# EasyEDA Pro project stm32devboard_f103c6.eprj

# Schematic Schematic1
Create Date: 2022-06-30; Page Name: P1; Project Name: stm32devboard_f103c6; Schematic Name: Schematic1; Update Date: 2022-09-17
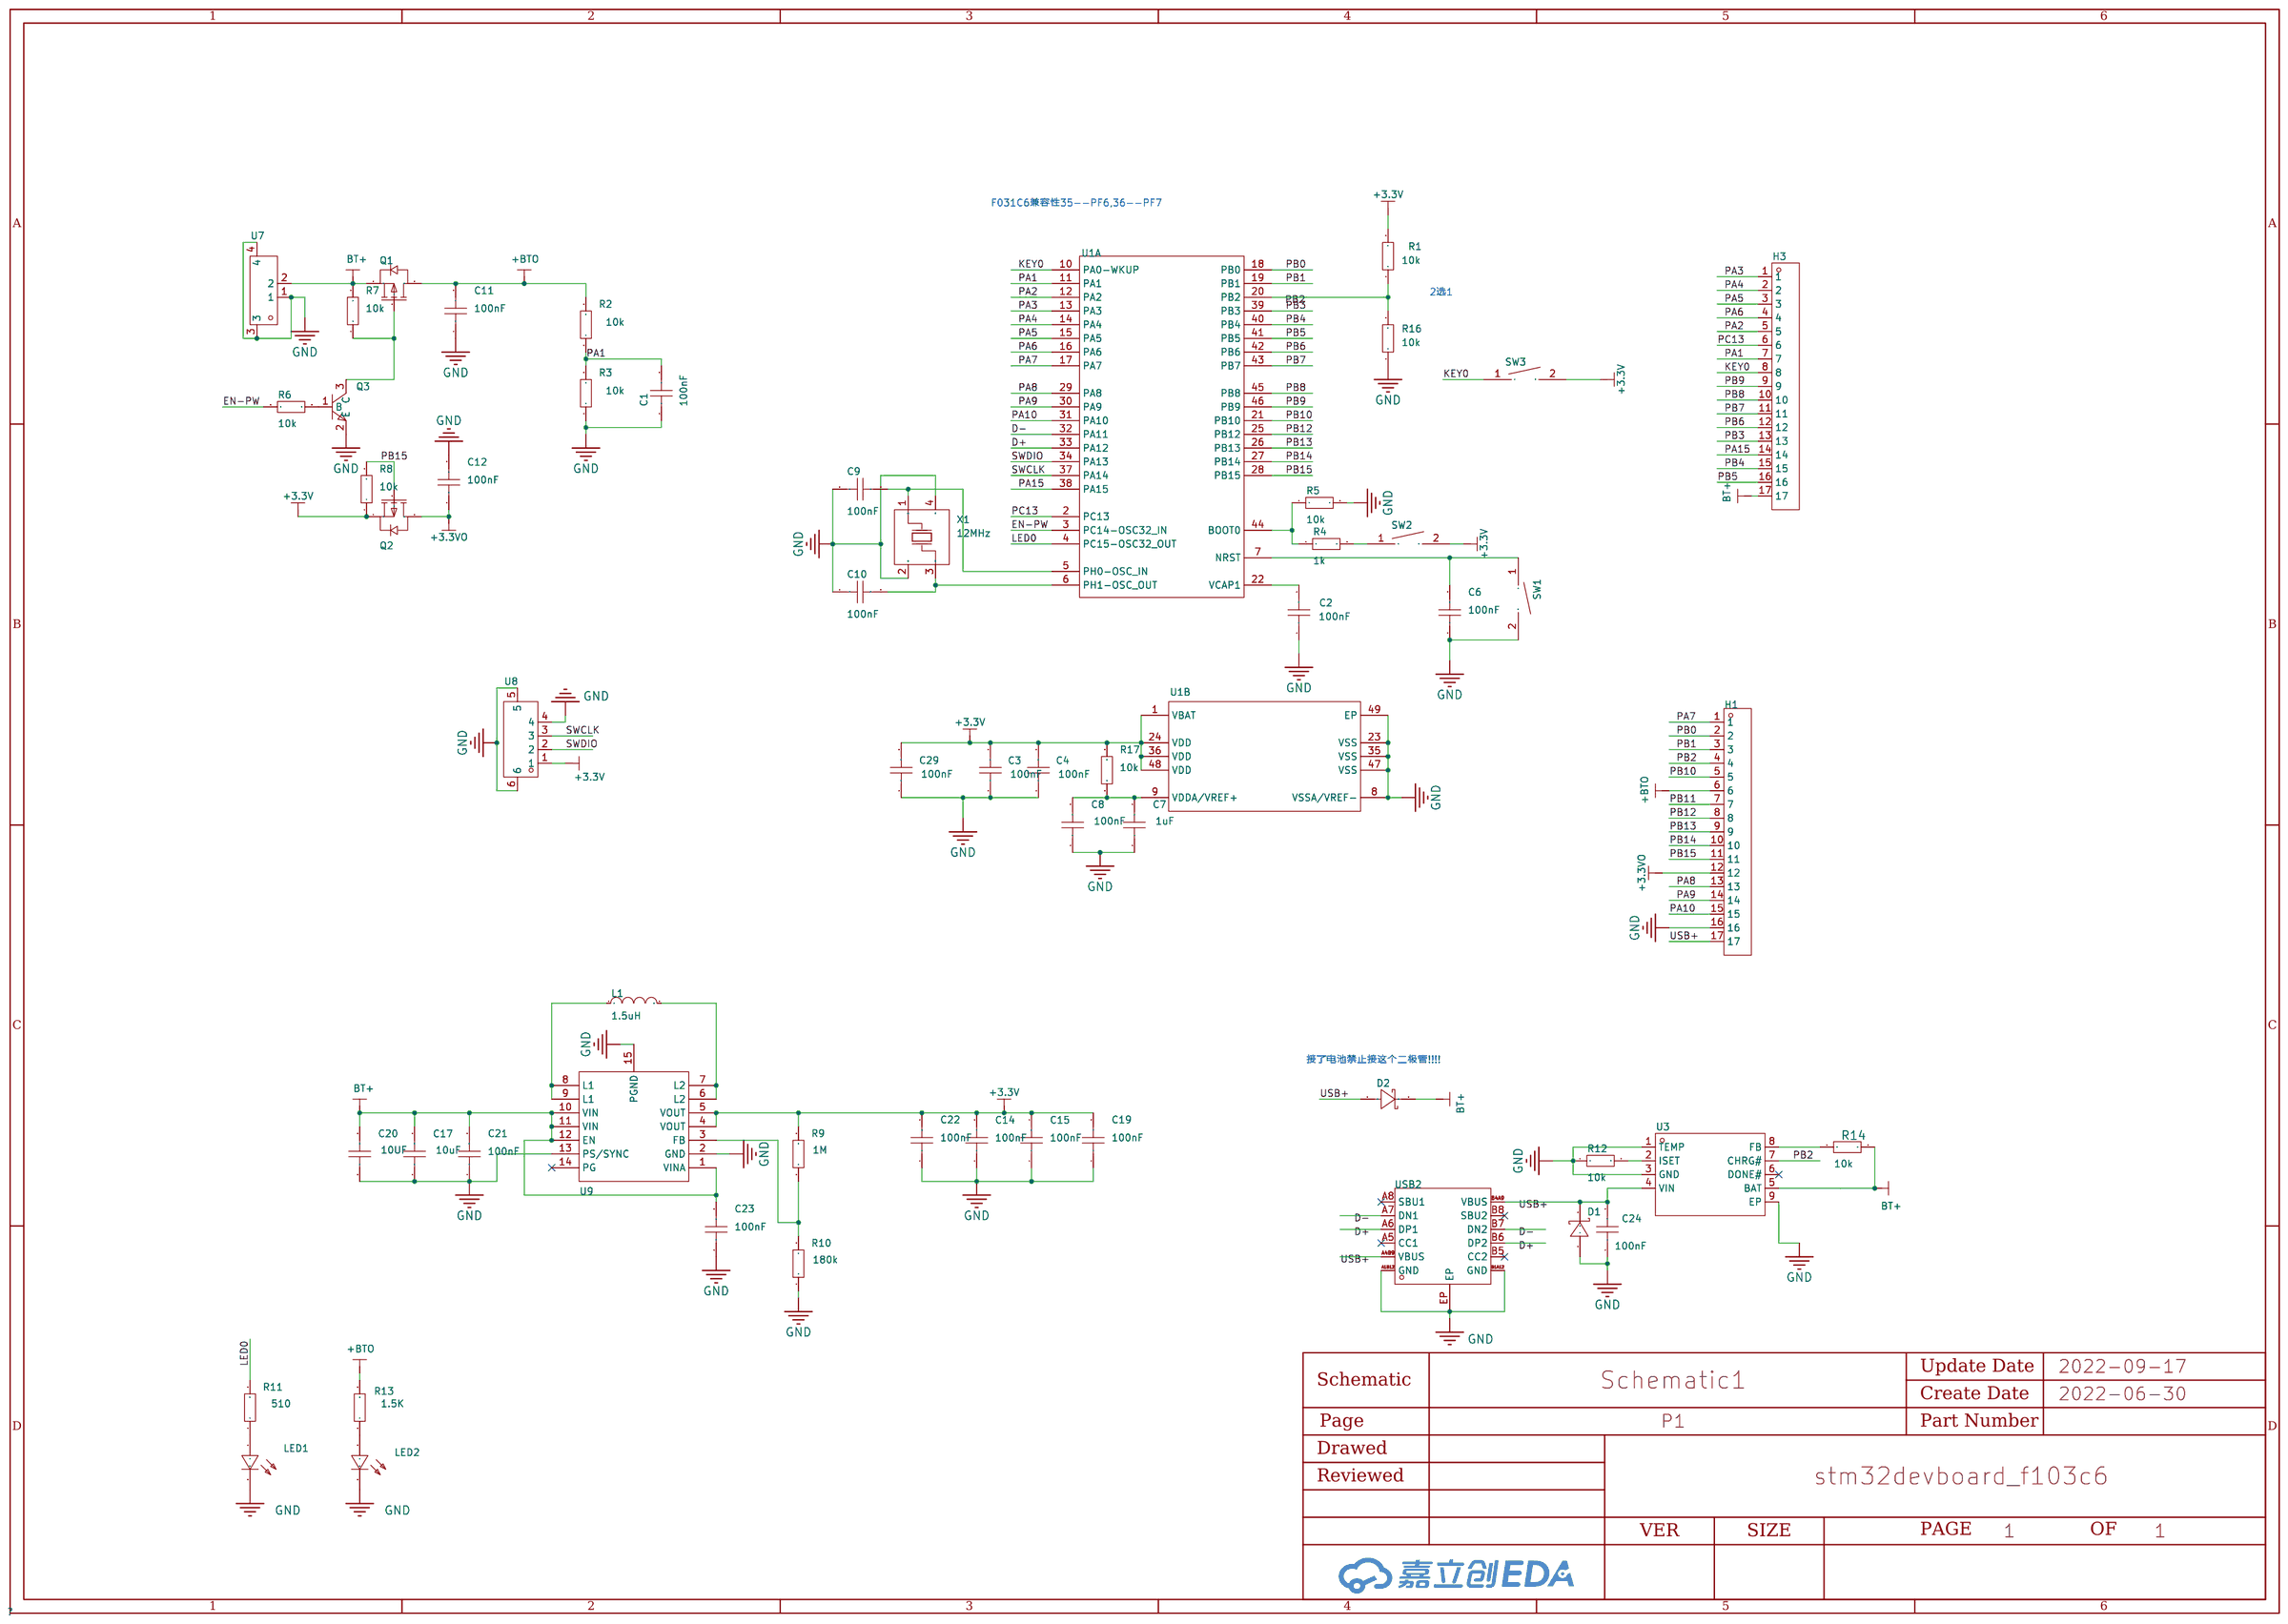
[diagram p0: schematic sheet]

## Parts
C1  100nF  [C0402]
C2  100nF  [C0603]
C3  100nF  [C0603]
C4  100nF  [C0603]
C6  100nF  [C0603]
C7  1uF  [C0603]
C8  100nF  [C0603]
C9  100nF  [C0603]
C10  100nF  [C0603]
C11  100nF  [C0603]
C12  100nF  [C0603]
C14  100nF  [C0603]
C15  100nF  [C0603]
C17  10uF  [C0603]
C19  100nF  [C0603]
C20  10UF  [C0603]
C21  100nF  [C0402]
C22  100nF  [C0402]
C23  100nF  [C0603]
C24  100nF  [C0603]
C29  100nF  [C0402]
D1  -  [SOD-123FL_L2.6-W1.6-LS3.4-R-FD]
D2  1N5819WS S4  [SOD-323_L1.6-W1.3-LS2.7-RD]
H1  X6511WV-17H-C30D60  [HDR-TH_17P-P2.54-V-M]
H3  X6511WV-17H-C30D60  [HDR-TH_17P-P2.54-V-M]
L1  1.5uH  [IND-SMD_L4.0-W4.0_FNR40XXS]
LED1  -  [LED0603-R-RD]
LED2  -  [LED0603-R-RD]
Q1  -  [SOT-23-3_L2.9-W1.3-P1.90-LS2.4-TR]
Q2  -  [SOT-23-3_L2.9-W1.3-P1.90-LS2.4-TR]
Q3  -  [SOT-23-3_L2.9-W1.3-P1.90-LS2.4-BR]
R1  10k  [R0603]
R2  10k  [R0603]
R3  10k  [R0603]
R4  1k  [R0603]
R5  10k  [R0603]
R6  10k  [R0603]
R7  10k  [R0603]
R8  10k  [R0603]
R9  1M  [R0603]
R10  180k  [R0603]
R11  510  [R0603]
R12  10k  [R0603]
R13  1.5K  [R0603]
R14  10k  [R0603_1]
R16  10k  [R0603]
R17  10k  [R0603]
SW1  TSA343G00-250J2  [SW-SMD_L4.0-W2.9-LS5.0]
SW2  TSA343G00-250J2  [SW-SMD_L4.0-W2.9-LS5.0]
SW3  TSA343G00-250J2  [SW-SMD_L4.0-W2.9-LS5.0]
U1  STM32F401CCU6  [UFQFPN-48_L7.0-W7.0-P0.50-BL-EP]  (sections 1,2)
U3  CN3058E  [SOIC-8_L4.9-W3.9-P1.27-LS6.0-BL-EP3.3]
U7  -  [CONN-SMD_2P-P1.25_GH1.25-2P]
U8  WAFER-GH1.25-4PLB  [CONN-TH_4P-P1.25_XUNPU_WAFER-GH1.25-4PLB]
U9  -  [VSON-14_L4.0-W3.0-P0.50-BL-EP_TI_DSJ]
USB2  TYPEC-304-ACP16  [USB-C-SMD_TYPE-C-16P-1_1]
X1  12MHz  [OSC-SMD_4P-L3.2-W2.5-BL_1]

## Library data of the parts
C1 C21 C22 C29 = FN15X104K250PNG: 容值:100nF;精度:±10%;额定电压:25V;温度系数:X7R;; LCSC Part Name: 100nF ±10% 25V; Supplier Part: C525225; Manufacturer: PSA(信昌电陶); Supplier Footprint: 0402; JLCPCB Part Class: Extended Part; Datasheet: https://atta.szlcsc.com/upload/public/pdf/source/20200506/C436246_4EAA78C9048D88437BAF2CB7B8BE45FD.pdf; Supplier: LCSC; Tolerance: ±10%; Voltage Rated: 25V; Temperature Coefficient: X7R
C2-C4 C6-C12 C14 C15 C17 C19 C20 C23 C24 = CC0603KRX7R9BB104: 容值:100nF;精度:±10%;额定电压:50V;温度系数:X7R;; LCSC Part Name: 100nF ±10% 50V; Supplier Part: C14663; Manufacturer: YAGEO(国巨); Supplier Footprint: 0603; JLCPCB Part Class: Basic Part; Datasheet: https://atta.szlcsc.com/upload/public/pdf/source/20170116/1484561234239.pdf; Supplier: LCSC; Tolerance: ±10%; Voltage Rated: 50V; Temperature Coefficient: X7R
D1 = SMFJ5.0A: 极性:单向;反向截止电压(Vrwm):5V;击穿电压(最小值):6.4V;峰值脉冲电流(Ipp)@10/1000s:21.7A;最大钳位电压:9.4V;; LCSC Part Name: 单向 5V; Supplier Part: C151893; Manufacturer: BORN伯恩半导体; Supplier Footprint: SOD-123F; JLCPCB Part Class: Extended Part; Datasheet: https://atta.szlcsc.com/upload/public/pdf/source/20171211/C151893_15129764343031175501.pdf; Supplier: LCSC; Polarity: 单向; Reverse Stand-Off Voltage (Vrwm): 5V; Breakdown Voltage (Min): 6.4V; Peak Pulse Current (Ipp)@10/1000μs: 21.7A; Maximum Clamping Voltage: 9.4V
D2 = 1N5819WS S4: 二极管配置:独立式;直流反向耐压(Vr):40V;平均整流电流(Io):350mA;正向压降(Vf):600mV@200mA;反向电流(Ir):5A@30V;; LCSC Part Name: 40V 350mA 600mV@200mA; Supplier Part: C2927280; Manufacturer: JSMSEMI(杰盛微); Supplier Footprint: SOD-323; JLCPCB Part Class: Extended Part; Datasheet: https://atta.szlcsc.com/upload/public/pdf/source/20211230/020DF3ABCB41CBA5E28580D63AFB2CA3.pdf; Supplier: LCSC; Diode Configuration: 独立式; Reverse Voltage (Vr): 40V; Average Rectified Current (Io): 350mA; Forward Voltage (Vf@If): 600mV@200mA; Reverse Leakage Current (Ir): 5A@30V
H1 H3 = X6511WV-17H-C30D60: 间距:2.54mm;总PIN位数:17;排数:1;插针结构:1x17P;行距:-;安装类型:直插;圆针/方针:方针;额定电流:3A;额定电压:250V;配合针长度:6mm;塑高:2.5mm;端接针长度:3mm;触头材质:黄铜;触头镀层:金;工作温度范围:-40~+105;焊接温度(最大值):260;颜色:黑色;; LCSC Part Name: 2.54mm 1x17P 直插 方针; Supplier Part: C725949; Manufacturer: XKB Connectivity(中国星坤); Supplier Footprint: 直插,P=2.54mm; JLCPCB Part Class: Extended Part; Datasheet: https://atta.szlcsc.com/upload/public/pdf/source/20211009/D19569EFFEB9776B42364DF7D41FD96A.pdf; Supplier: LCSC; Pitch: 2.54mm; Number of Pins: 17; Number of Rows: 1; Pin Structure: 1x17P; Mounting Type: 直插; Circluar Pins/Square Pins: 方针; Current Rating (Max): 3A; Voltage Rating (Max): 250V; Length of Mating Pin: 6mm; Insulation Height: 2.5mm; Length of End Connection Pin: 3mm; Contact Material: 黄铜; Contact Plating: 金; Operating Temperature Range: -40~+105; Welding Temperature (Max): 260; Color: 黑色
L1 = FNR4030S1R5MT: 电感值:1.5uH;精度:±20%;额定电流:3.34A;直流电阻(DCR):26m;; LCSC Part Name: 1.5uH ±20% 3.34A 26m; Supplier Part: C167867; Manufacturer: cjiang(长江微电); Supplier Footprint: SMD; JLCPCB Part Class: Extended Part; Datasheet: https://atta.szlcsc.com/upload/public/pdf/source/20190327/C167867_08768CA7262D1F95412648A118D7A069.pdf; Supplier: LCSC; Tolerance: ±20%; Rated Current: 3.34A; DC Resistance (DCR): 26m
LED1 LED2 = 19-217/GHC-YR1S2/3T: 照明颜色:翠绿;色温 - CCT（K）:-;主波长/色坐标:520~535nm;; LCSC Part Name: 翠绿LED; Supplier Part: C72043; Manufacturer: EVERLIGHT(台湾亿光); Supplier Footprint: 0603; JLCPCB Part Class: Basic Part; Datasheet: https://atta.szlcsc.com/upload/public/pdf/source/20160507/1462613613780.pdf; Supplier: LCSC; Mounting Type: 表面贴装; Illumination Color: 翠绿; Luminous Intensity (IF=20mA): 112~258mcd; Dominant Wavelength / Coordinate rank: 520~535nm
Q1 Q2 = AP2301B: 类型:P沟道;漏源电压(Vdss):20V;连续漏极电流(Id):2A;功率(Pd):750mW;导通电阻(RDS(on)@Vgs,Id):130m@4.5V,2A;阈值电压(Vgs(th)@Id):950mV@250uA;栅极电荷(Qg@Vgs):-;输入电容(Ciss@Vds):210pF@6V;反向传输电容(Crss@Vds):27pF@6V;; LCSC Part Name: P沟道 20V 2A; Supplier Part: C2763847; Manufacturer: ALLPOWER(铨力); Supplier Footprint: SOT-23-3; JLCPCB Part Class: Extended Part; Datasheet: https://atta.szlcsc.com/upload/public/pdf/source/20210401/C2763847_842F2A0FFE6F1F01F619022F78C12F29.pdf; Supplier: LCSC; Type: P沟道; Drain Source Voltage (Vdss): 20V; Continuous Drain Current (Id): 2A; Power Dissipation (Pd): 750mW; Drain Source On Resistance (RDS(on)@Vgs,Id): 130m@4.5V,2A; Gate Threshold Voltage (Vgs(th)@Id): 950mV@250uA; Input Capacitance (Ciss@Vds): 210pF@6V; Reverse Transfer Capacitance (Crss@Vds): 27pF@6V
Q3 = S8050 J3Y: LCSC Part Name: S8050; Supplier Part: C2926165; Manufacturer: FOSAN(富信); Supplier Footprint: SOT-23; JLCPCB Part Class: Extended Part; Datasheet: https://atta.szlcsc.com/upload/public/pdf/source/20211203/FAF9E446EEEFA352739C30D23AB52B1B.pdf; Supplier: LCSC
R1-R13 R16 R17 = TR0603B10K0P0525Z: 电阻类型:薄膜电阻;阻值:10k;精度:±0.1%;功率:100mW;温度系数:±25ppm/;最大工作电压:75V;工作温度范围:-55~+155;; LCSC Part Name: 10k ±0.1% 100mW; Supplier Part: C188363; Manufacturer: EVER OHMS(天二科技); Supplier Footprint: 0603; JLCPCB Part Class: Extended Part; Datasheet: https://atta.szlcsc.com/upload/public/pdf/source/20190415/C188363_433BF05B6FB8F7A0F5F35A3E4390C55A.pdf; Supplier: LCSC; Type: 薄膜电阻; Tolerance: ±0.1%; Power(Watts): 100mW; Temperature Coefficient: ±25ppm/; Overload Voltage (Max): 75V; Operating Temperature Range: -55~+155
R14 = TR0603B10K0P0525Z_1: 阻值:10k;精度:±0.1%;温度系数:±25ppm/;功率:100mW;工作温度范围:-55~+155;电阻类型:薄膜电阻;最大工作电压:75V;; LCSC Part Name: 10k ±0.1%; Supplier Part: C188363; Manufacturer: EVER OHMS(天二科技); Manufacturer Part: TR0603B10K0P0525Z; LCSC Stock: 82487; LCSC On Sale: 1; Supplier Footprint: 0603; Price: 0.179; JLCPCB Part Class: Extended Part; JLCPCB Stock: 0; JLCPCB On Sale: 0; Datasheet: https://atta.szlcsc.com/upload/public/pdf/source/20190415/C188363_433BF05B6FB8F7A0F5F35A3E4390C55A.pdf; Supplier: LCSC; Tolerance: ±0.1%; Temperature Coefficient: ±25ppm/; Power(Watts): 100mW; Operating Temperature Range: -55~+155; Type: 薄膜电阻; Overload Voltage (Max): 75V
SW1-SW3 = TSA343G00-250J2: 触点电流:50mA;额定电压(DC):12V;绝缘电阻:100M;电路结构:单刀单掷;安装方式:立贴;按钮形状:圆形按钮;按钮/盖帽颜色:黑色;带灯:无;作用力:250gf@±50gf;机械寿命:50000;工作温度:-25~+70;引脚样式:SMD接片;开关长度:3.95mm;开关宽度:2.9mm;开关高度:2mm;带支架:否;; LCSC Part Name: 3*4 两脚小龟不带柱  250gf; Supplier Part: C354946; Manufacturer: BRIGHT(博瑞泰); Supplier Footprint: SMD; JLCPCB Part Class: Extended Part; Datasheet: https://atta.szlcsc.com/upload/public/pdf/source/20190426/C354946_6B70DFBDFA823D17B8EB46FB9599F693.pdf; Supplier: LCSC; Contact Current: 50mA; Voltage Rating (DC): 12V; Insulation Resistance: 100M; Circuit: 单刀单掷; Mounting Style: 立贴; Actuator Style: 圆形按钮; Actuator/Cap Color: 黑色; With Lamp: 无; Operating Force: 250gf@±50gf; Mechanical Life: 50000; Operating Temperature: -25~+70; Pin Style: SMD接片; Switch Length: 3.95mm; Switch Width: 2.9mm; Switch Height: 2mm; Strike Gundam: 否
U1 = STM32F401CCU6: 主频（MAX):84MHz;工作电压:1.7V ~ 3.6V;; Supplier Part: C79861; Manufacturer: ST(意法半导体); Supplier Footprint: UFQFPN-48; JLCPCB Part Class: Extended Part; Datasheet: https://atta.szlcsc.com/upload/public/pdf/source/20160816/1471343009422.pdf; Supplier: LCSC; Speed: 84MHz; Voltage - Supply (Vcc/Vdd): 1.7V ~ 3.6V; Program Memory Size: 256KB; RAM Size: 64KB; Number of I/O: 36; A/D: 10x12bit; PWM: 32; UART/USART: 3 USART; SPI: 3; I2C（SMBUS/PMBUS）: 3; USB Device: 1; USB Host/OTG: 1
U3 = CN3058E: 充电电池的类型:-;电池单元组数:-;最大充电电流:-;充满的电池组电压:-;最大供应电压:-;; Supplier Part: C112011; Manufacturer: CONSONANCE(上海如韵); Supplier Footprint: SOP-8_150mil; JLCPCB Part Class: Extended Part; Datasheet: https://atta.szlcsc.com/upload/public/pdf/source/20170717/C112011_1500269941276820724.pdf; Supplier: LCSC
U7 = GH1.25-2PLTPZ: LCSC Part Name: GH1.25-2P立贴编带加盖; Supplier Part: C2829260; Manufacturer: BOOMELE(博穆精密); JLCPCB Part Class: Extended Part; Datasheet: https://atta.szlcsc.com/upload/public/pdf/source/20211125/08A09A4909F58AF780B71FE423A00F7E.pdf; Supplier: LCSC
U8 = WAFER-GH1.25-4PLB: 参考系列:GH;间距:1.25mm;插针结构:1x4P;排数:1;每排PIN数:4;公母:公型插针;安装方式:立贴;额定电流:1A;工作温度范围:-25℃~+85℃;; LCSC Part Name: GH1.25mm 4P 立贴带扣 带扣; Supplier Part: C3029370; Manufacturer: XUNPU(讯普); Supplier Footprint: SMD,P=1.25mm; JLCPCB Part Class: Extended Part; Datasheet: https://atta.szlcsc.com/upload/public/pdf/source/20220527/44F824AAC8C2B617205E15955FF9C23D.pdf; Supplier: LCSC; Reference Series: GH; Pitch: 1.25mm; Pins Structure: 1x4P; Number of Rows: 1; Number of PINs Per Row: 4; Gender: 公型插针; Mounting Style: 立贴; Current Rating (Max): 1A; Operating Temperature Range: -25℃~+85℃
U9 = TPS63020DSJR: 功能类型:升降压型;同步整流:是;输出通道数:1;拓扑结构:降压-升压式;输入电压:1.8V~5.5V;输出电压:1.2V~5.5V;输出电流(最大值):3.5A;开关频率:2.4MHz;; LCSC Part Name: 升降压型 1.8V~5.5V 3.5A 2.4MHz; Supplier Part: C15483; Manufacturer: TI(德州仪器); Supplier Footprint: VSON-14_3x4x05P; JLCPCB Part Class: Extended Part; Datasheet: https://atta.szlcsc.com/upload/public/pdf/source/20140704/1457707124625.pdf; Supplier: LCSC; Function: 升降压型; Synchronous Rectification: 是; Number of Outputs: 1; Topology: 降压-升压式; Input Voltage: 1.8V~5.5V; Output Voltage: 1.2V~5.5V; Output Current (Max): 3.5A; Switching Frequency: 2.4MHz
USB2 = TYPEC-304-ACP16: 连接器类型:Type-C;公母:母座;触点数量:16;端口数量:1;安装方式:卧贴;额定电流 - 电源:3A;工作温度范围:-40~+85;; LCSC Part Name: Type-C 母座 卧贴; Supplier Part: C2982555; Manufacturer: XUNPU(讯普); Supplier Footprint: SMD; JLCPCB Part Class: Extended Part; Datasheet: https://atta.szlcsc.com/upload/public/pdf/source/20220311/3C907F75E12F45E4EE7F73565AB9C294.pdf; Supplier: LCSC; Connector Type: Type-C; Gender: 母座; Number of Contacts: 16; Number of Ports: 1; Mounting Style: 卧贴; Current Rating - Power (Max): 3A; Operating Temperature Range: -40~+85
X1 = X322512MSB4SI: 晶振类型:贴片无源晶振;频率:12MHz;频率公差:±10ppm;频率稳定度:±30ppm;负载电容:20pF;工作温度:-40~+85;; LCSC Part Name: 12MHz ±10ppm 20pF; Supplier Part: C9002; Manufacturer: YXC扬兴科技; Supplier Footprint: SMD3225-4P; JLCPCB Part Class: Basic Part; Datasheet: https://atta.szlcsc.com/upload/public/pdf/source/20210329/C112971_1F611BDC486E193C1706F6D8EB5AA189.pdf; Supplier: LCSC; Crystal Type: 贴片无源晶振; Frequency Tolerance: ±10ppm; Frequency Stability: ±30ppm; Load Capacitance: 20pF; Operating Temperature: -40~+85

## Nets
+3.3V: C3.2 C4.2 C14.2 C15.2 C19.2 C22.2 C29.2 Q2.1(S) R1.2 R8.1 R9.2 R17.2 SW2.2 SW3.2 U1.1(VBAT) U1.24(VDD) U1.36(VDD) U1.48(VDD) U8.1 U9.4(VOUT) U9.5(VOUT)
+3.3VO: C12.1 H1.12 Q2.3(D)
GND: C1.1 C2.1 C3.1 C4.1 C6.1 C7.1 C8.1 C9.1 C10.1 C11.1 C12.2 C14.1 C15.1 C17.1 C19.1 C20.1 C21.1 C22.1 C23.1 C24.1 C29.1 D1.2(A) H1.16 LED1.2(C) LED2.2(C) Q3.2(E) R3.1 R5.2 R10.1 R12.1 R16.1 SW1.2 U1.8(VSSA/VREF-) U1.23(VSS) U1.35(VSS) U1.47(VSS) U1.49(EP) U3.1(TEMP) U3.3(GND) U3.9(EP) U7.1 U7.3 U7.4 U8.4 U8.5 U8.6 U9.2(GND) U9.13(PS/SYNC) U9.15(PGND) USB2.A1B12(GND) USB2.B1A12(GND) USB2.EP X1.2(GND) X1.4(GND)
+BTO: C11.2 H1.6 Q1.3(D) R2.2 R13.2
BT+: C17.2 C20.2 C21.2 C23.2 D2.1(C) H3.17 Q1.1(S) R7.2 R14.2 U3.5(BAT) U7.2 U9.1(VINA) U9.10(VIN) U9.11(VIN) U9.12(EN)
D+: U1.33(PA12) USB2.A6(DP1) USB2.B6(DP2)
D-: U1.32(PA11) USB2.A7(DN1) USB2.B7(DN2)
EN-PW: R6.1 U1.3(PC14-OSC32_IN)
KEY0: H3.8 SW3.1 U1.10(PA0-WKUP)
LED0: R11.2 U1.4(PC15-OSC32_OUT)
PA1: C1.2 H3.7 R2.1 R3.2 U1.11(PA1)
PA2: H3.5 U1.12(PA2)
PA3: H3.1 U1.13(PA3)
PA4: H3.2 U1.14(PA4)
PA5: H3.3 U1.15(PA5)
PA6: H3.4 U1.16(PA6)
PA7: H1.1 U1.17(PA7)
PA8: H1.13 U1.29(PA8)
PA9: H1.14 U1.30(PA9)
PA10: H1.15 U1.31(PA10)
PA15: H3.14 U1.38(PA15)
PB0: H1.2 U1.18(PB0)
PB1: H1.3 U1.19(PB1)
PB2: H1.4 R1.1 R16.2 U1.20(PB2) U3.7(CHRG#)
PB3: H3.13 U1.39(PB3)
PB4: H3.15 U1.40(PB4)
PB5: H3.16 U1.41(PB5)
PB6: H3.12 U1.42(PB6)
PB7: H3.11 U1.43(PB7)
PB8: H3.10 U1.45(PB8)
PB9: H3.9 U1.46(PB9)
PB10: H1.5 U1.21(PB10)
PB11: H1.7
PB12: H1.8 U1.25(PB12)
PB13: H1.9 U1.26(PB13)
PB14: H1.10 U1.27(PB14)
PB15: H1.11 Q2.2(G) R8.2 U1.28(PB15)
PC13: H3.6 U1.2(PC13)
SWCLK: U1.37(PA14) U8.3
SWDIO: U1.34(PA13) U8.2
USB+: C24.2 D1.1(K) D2.2(A) H1.17 U3.4(VIN) USB2.A4B9(VBUS) USB2.B4A9(VBUS)
$1N3171: R4.1 R5.1 U1.44(BOOT0)
$1N3579: R4.2 SW2.1
$1N5109: C6.2 SW1.1 U1.7(NRST)
$1N7030: C10.2 U1.6(PH1-OSC_OUT) X1.3(OSC2)
$1N7055: C9.2 U1.5(PH0-OSC_IN) X1.1(OSC1)
$1N11417: Q3.1(B) R6.2
$1N11548: Q1.2(G) Q3.3(C) R7.1
$1N17740: L1.1 U9.8(L1) U9.9(L1)
$1N17819: L1.2 U9.6(L2) U9.7(L2)
$1N22362: R9.1 R10.2 U9.3(FB)
$1N29393: LED1.1(A) R11.1
$1N31043: R12.2 U3.2(ISET)
$1N41930: LED2.1(A) R13.1
$1N62242: R14.1 U3.8(FB)
$1N66182: C7.2 C8.2 R17.1 U1.9(VDDA/VREF+)
$1N92946: C2.2 U1.22(VCAP1)

Not connected (* = marked no-connect by the designer): U3 6(DONE#)*; U9 14(PG)*; USB2 A5(CC1)* A8(SBU1)* B5(CC2)* B8(SBU2)*

## Notes on the sheet
- F031C6兼容性35--PF6,36--PF7
- 2选1
- 接了电池禁止接这个二极管!!!!

# Board PCB1
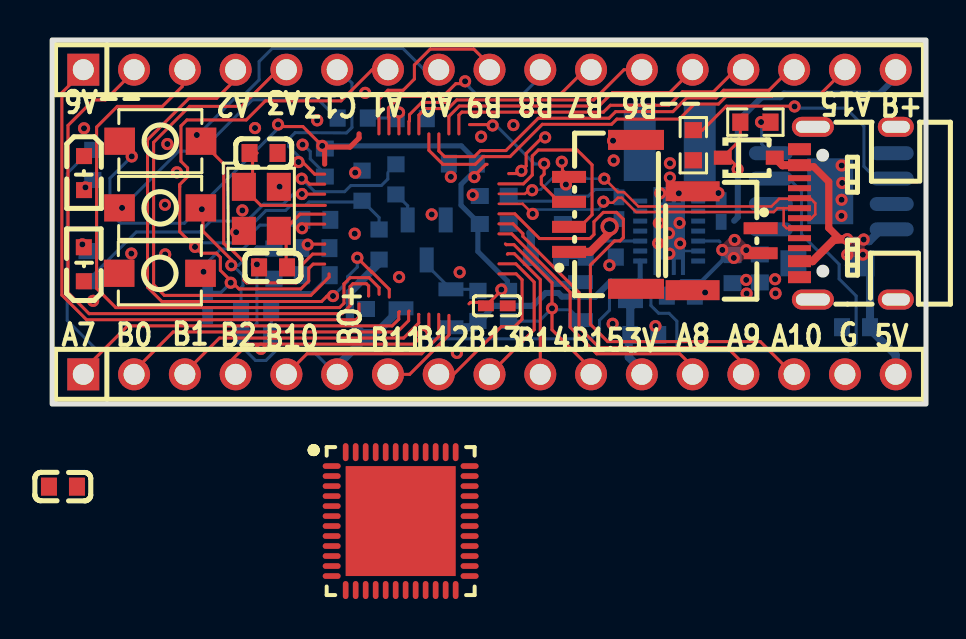
[diagram p1: board, top side]
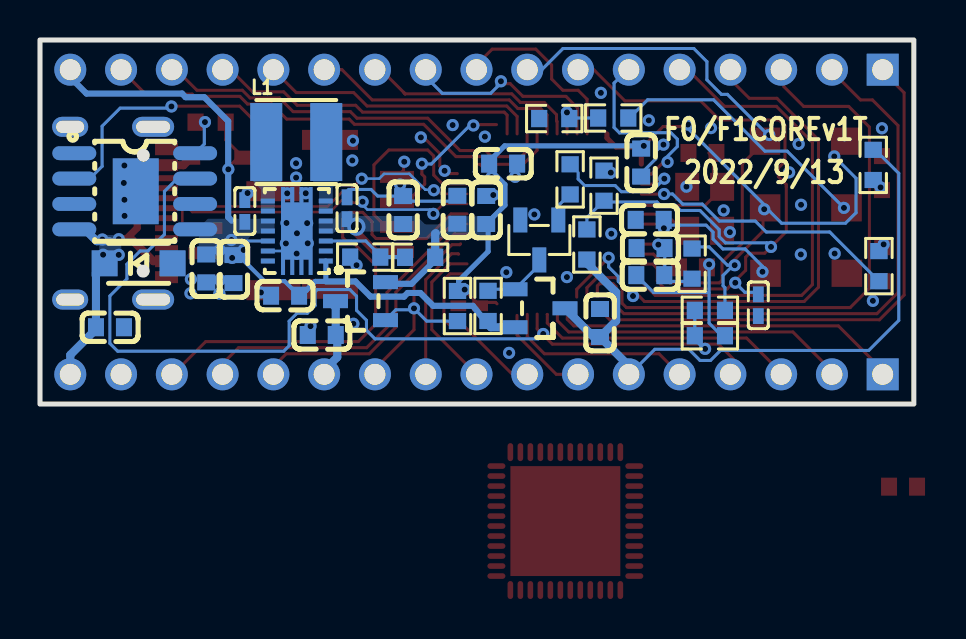
[diagram p2: board, bottom side, seen from below]

Outline 43.71 x 18.21 mm; copper layers: Top Layer, Bottom Layer. Coordinates in mm from the lower left corner of the outline.
Outline path: rectangle 0,18.21 43.71,0
Stack: Top Layer 0.035mm / 介电1 1.51mm FR4 er 4.5 / Bottom Layer 0.035mm

## Design rules (mm)
net D-: DP1
net D+: DP1
spacing safeClearance (default): track to track 0.152, other pairs 0.152 to 0.3
track width trackWidth (default): min 0.127, default 0.152, max 2.54
differential pair differentialPair (default): width min 0.127, default 0.254, max 2.54; gap min 0.152, default 0.152
via viaSize (default): diameter min 0.5, default 0.61, max 10; hole min 0.3, default 0.305, max 6

## Placement (name value [footprint] x y rotation side)
C1  100nF  [C0402]  7.78 4.94 90 bottom
C2  100nF  [C0603]  0.54 -4.13 0 top
C3  100nF  [C0603]  13.64 12.08 90 bottom
C4  100nF  [C0603]  20.54 12.03 0 bottom
C6  100nF  [C0603]  13.21 9.22 180 bottom
C7  1uF  [C0603]  13.18 6.45 180 bottom
C8  100nF  [C0603]  13.17 7.8 180 bottom
C9  100nF  [C0603]  10.58 12.56 180 top
C10  100nF  [C0603]  11.05 6.84 0 top
C11  100nF  [C0603]  15.7 4.05 270 bottom
C12  100nF  [C0603]  29.62 3.45 0 bottom
C14  100nF  [C0603]  21.39 9.71 270 bottom
C15  100nF  [C0603]  25.55 9.7 270 bottom
C17  10uF  [C0603]  34.03 6.75 90 bottom
C19  100nF  [C0603]  22.84 9.72 270 bottom
C20  10UF  [C0603]  35.4 6.78 90 bottom
C21  100nF  [C0402]  33.47 9.66 270 bottom
C22  100nF  [C0402]  28.35 9.8 270 bottom
C23  100nF  [C0603]  31.45 5.42 180 bottom
C24  100nF  [C0603]  40.21 3.84 0 bottom
C29  100nF  [C0402]  22.24 4.91 180 top
D1  -  [SOD-123FL_L2.6-W1.6-LS3.4-R-FD]  38.78 7.04 0 bottom
D2  1N5819WS S4  [SOD-323_L1.6-W1.3-LS2.7-RD]  34.85 12.32 0 top
H1  X6511WV-17H-C30D60  [HDR-TH_17P-P2.54-V-M]  21.88 1.49 0 top
H3  X6511WV-17H-C30D60  [HDR-TH_17P-P2.54-V-M]  21.88 16.73 0 top
L1  1.5uH  [IND-SMD_L4.0-W4.0_FNR40XXS]  30.9 13.11 180 bottom
LED1  -  [LED0603-R-RD]  1.59 6.99 90 top
LED2  -  [LED0603-R-RD]  1.59 11.55 270 top
Q1  -  [SOT-23-3_L2.9-W1.3-P1.90-LS2.4-TR]  18.7 4.79 0 bottom
Q2  -  [SOT-23-3_L2.9-W1.3-P1.90-LS2.4-TR]  27.68 5.15 180 bottom
Q3  -  [SOT-23-3_L2.9-W1.3-P1.90-LS2.4-BR]  18.74 8.21 90 bottom
R1  10k  [R0603]  10.2 4.69 180 bottom
R2  10k  [R0603]  16.36 7.98 270 bottom
R3  10k  [R0603]  15.5 10.92 270 bottom
R4  1k  [R0603]  15.04 14.31 180 bottom
R5  10k  [R0603]  17.99 14.28 0 bottom
R6  10k  [R0603]  17.19 11.24 270 bottom
R7  10k  [R0603]  21.3 4.91 270 bottom
R8  10k  [R0603]  22.83 4.9 270 bottom
R9  1M  [R0603]  24.7 7.34 180 bottom
R10  180k  [R0603]  27.44 7.35 180 bottom
R11  510  [R0603]  1.75 6.9 270 bottom
R12  10k  [R0603]  32.07 12.95 90 top
R13  1.5K  [R0603]  2.03 11.96 90 bottom
R14  10k  [R0603_1]  35.18 14.1 180 top
R16  10k  [R0603]  10.2 3.42 0 bottom
R17  10k  [R0603]  11.1 7.02 90 bottom
SW1  TSA343G00-250J2  [SW-SMD_L4.0-W2.9-LS5.0]  5.39 6.54 180 top
SW2  TSA343G00-250J2  [SW-SMD_L4.0-W2.9-LS5.0]  5.4 9.81 0 top
SW3  TSA343G00-250J2  [SW-SMD_L4.0-W2.9-LS5.0]  5.41 13.15 180 top
U1  STM32F401CCU6  [UFQFPN-48_L7.0-W7.0-P0.50-BL-EP]  17.43 -5.85 270 top
U3  CN3058E  [SOIC-8_L4.9-W3.9-P1.27-LS6.0-BL-EP3.3]  38.97 10.64 270 bottom
U7  -  [CONN-SMD_2P-P1.25_GH1.25-2P]  33.74 8.17 270 top
U8  WAFER-GH1.25-4PLB  [CONN-TH_4P-P1.25_XUNPU_WAFER-GH1.25-4PLB]  27.53 9.49 90 top
U9  -  [VSON-14_L4.0-W3.0-P0.50-BL-EP_TI_DSJ]  30.87 8.66 90 bottom
USB2  TYPEC-304-ACP16  [USB-C-SMD_TYPE-C-16P-1_1]  39.79 9.55 90 top
X1  12MHz  [OSC-SMD_4P-L3.2-W2.5-BL_1]  10.47 9.77 270 top

## Footprints (pads in the part's own frame, mm; a bottom-side part is the same pattern mirrored in y, then rotated)
C0402
  rect 0.79x0.54 smd: 1(-0.545,0) 2(0.545,0)
C0603
  rect 0.8x0.9 smd: 1(-0.7,0) 2(0.7,0)
CONN-SMD_2P-P1.25_GH1.25-2P
  rect 0.6x1.7 smd: 1(-0.625,1.702) 2(0.625,1.702)
  rect 1.001x2.7 smd: 3(2.474,-1.702) 4(-2.474,-1.696)
CONN-TH_4P-P1.25_XUNPU_WAFER-GH1.25-4PLB
  rect 0.6x1.7 smd: 1(-1.875,1.675) 2(-0.625,1.675) 3(0.625,1.675) 4(1.875,1.675)
  rect 1x2.8 smd: 5(-3.725,-1.675) 6(3.725,-1.675)
HDR-TH_17P-P2.54-V-M
  rect 1.6x1.6 hole 1.05: 1(-20.32,0)
  round 1.6 hole 1.05: 2(-17.78,0) 3(-15.24,0) 4(-12.7,0) 5(-10.16,0) 6(-7.62,0) 7(-5.08,0) 8(-2.54,0) 9(0,0) 10(2.54,0) 11(5.08,0) 12(7.62,0) 13(10.16,0) 14(12.7,0) 15(15.24,0) 16(17.78,0) 17(20.32,0)
IND-SMD_L4.0-W4.0_FNR40XXS
  rect 1.6x3.899 smd: 1(-1.501,0) 2(1.501,0)
LED0603-R-RD
  rect 0.8x0.8 smd: 1(0.851,0) 2(-0.851,0)
OSC-SMD_4P-L3.2-W2.5-BL_1
  rect 1.4x1.2 smd: 1(-1.1,-0.875) 2(1.1,-0.875) 3(1.1,0.875) 4(-1.1,0.875)
R0603
  rect 0.806x0.864 smd: 1(-0.753,0) 2(0.753,0)
R0603_1
  rect 0.807x0.864 smd: 1(-0.754,0) 2(0.754,0)
SOD-123FL_L2.6-W1.6-LS3.4-R-FD
  rect 1.3x1.3 smd: 1(1.7,0) 2(-1.7,0)
SOD-323_L1.6-W1.3-LS2.7-RD
  rect 0.899x0.701 smd: 1(-1.3,0) 2(1.3,0)
SOIC-8_L4.9-W3.9-P1.27-LS6.0-BL-EP3.3
  oval 0.7x2.2 smd: 1(-1.905,-3.022) 2(-0.635,-3.022) 3(0.635,-3.022) 4(1.905,-3.022) 5(1.905,3.022) 6(0.635,3.022) 7(-0.635,3.022) 8(-1.905,3.022)
  rect 3.3x2.3 smd: 9(0,0.051)
SOT-23-3_L2.9-W1.3-P1.90-LS2.4-BR
  rect 1.25x0.7 smd: 1(1,-0.95) 2(1,0.95) 3(-1,0)
SOT-23-3_L2.9-W1.3-P1.90-LS2.4-TR
  rect 1.25x0.701 smd: 1(1.25,0.95) 2(1.25,-0.95) 3(-1.25,0)
SW-SMD_L4.0-W2.9-LS5.0
  rect 1.53x1.36 smd: 1(-2.035,0) 2(2.035,0)
UFQFPN-48_L7.0-W7.0-P0.50-BL-EP
  oval 0.28x0.899 smd: 1(-2.751,-3.45) 2(-2.251,-3.45) 3(-1.75,-3.45) 4(-1.25,-3.45) 5(-0.75,-3.45) 6(-0.249,-3.45) 7(0.249,-3.45) 8(0.75,-3.45) 9(1.25,-3.45) 10(1.75,-3.45) 11(2.251,-3.45) 12(2.751,-3.45) 25(2.751,3.45) 26(2.251,3.45) 27(1.75,3.45) 28(1.25,3.45) 29(0.75,3.45) 30(0.249,3.45) 31(-0.249,3.45) 32(-0.75,3.45) 33(-1.25,3.45) 34(-1.75,3.45) 35(-2.251,3.45) 36(-2.751,3.45)
  oval 0.899x0.28 smd: 13(3.45,-2.751) 14(3.45,-2.251) 15(3.45,-1.75) 16(3.45,-1.25) 17(3.45,-0.75) 18(3.45,-0.249) 19(3.45,0.249) 20(3.45,0.75) 21(3.45,1.25) 22(3.45,1.75) 23(3.45,2.251) 24(3.45,2.751) 37(-3.45,2.751) 38(-3.45,2.251) 39(-3.45,1.75) 40(-3.45,1.25) 41(-3.45,0.75) 42(-3.45,0.249) 43(-3.45,-0.249) 44(-3.45,-0.75) 45(-3.45,-1.25) 46(-3.45,-1.75) 47(-3.45,-2.251) 48(-3.45,-2.751)
  rect 5.499x5.499 smd: 49(0,0)
USB-C-SMD_TYPE-C-16P-1_1
  rect 0.6x1.15 smd: A1B12(-3.2,2.41) A4B9(-2.4,2.41) B1A12(3.2,2.41) B4A9(2.4,2.41)
  rect 0.3x1.15 smd: A5(-1.25,2.41) A6(-0.25,2.41) A7(0.25,2.41) A8(1.25,2.41) B5(1.75,2.41) B6(0.75,2.41) B7(-0.75,2.41) B8(-1.75,2.41)
  oval 1x2.1 hole 0.6x1.7: EP(-4.32,1.74) EP(4.32,1.74)
  oval 1x1.8 hole 0.6x1.4: EP(-4.32,-2.41) EP(4.32,-2.41)
VSON-14_L4.0-W3.0-P0.50-BL-EP_TI_DSJ
  rect 0.25x0.7 smd: 1(-1.5,-1.45) 2(-1,-1.45) 3(-0.5,-1.45) 4(0,-1.45) 5(0.5,-1.45) 6(1,-1.45) 7(1.5,-1.45) 8(1.5,1.45) 9(1,1.45) 10(0.5,1.45) 11(0,1.45) 12(-0.5,1.45) 13(-1,1.45) 14(-1.5,1.45)
  custom 4.4x1.58 smd: 15(0,0)

## Nets
As in the schematic.

Pads without a net: U3 6; U9 14; USB2 A5 A8 B5 B8

## Via types
v1: diameter 0.61, hole 0.305, Top Layer to Bottom Layer, 97 vias
v2: diameter 0.914, hole 0.559, Top Layer to Bottom Layer, 1 via

## Routing (per net, layer and track width the routed paths; a pad name or vN(x,y) marks a point on that pad's centre or on a via; arc(x,y) is an arc through that point)
+3.3V: length 53.4
  Top Layer w0.152: v1(21.12,11.35) 21.12,11.41 21.69,11.99 21.76,11.99 ; v1(13.51,12.91) 12.54,13.88 11.33,13.88 ; 7.54,9.36 7.54,8.64 8.96,7.23 v1(8.96,6.94) ; C29.2 22.34,5.56 22.34,5.69 ; 20.85,5.01 20.92,5.08 21.63,5.08
  Top Layer w0.254: 13.62,12.85 14.9,12.85 15.35,13.31 15.35,13.51 ; 13.62,12.85 13.53,12.94 ; 13.62,12.85 13.53,12.94 ; 13.53,12.94 13.56,12.91 ; 13.53,12.94 13.63,12.84 13.63,12
  Top Layer w0.406: 27.96,8.91 27.96,8.65 26.92,7.61 U8.1
  Bottom Layer w0.152: 7.49,9.74 7.49,9.79 ; 7.49,9.79 7.44,9.75 7.31,9.75 6.61,9.04 3.42,9.04 2.89,9.57 2.89,11.3 v1(3.98,12.39) ; 7.49,9.79 7.49,9.97 11.3,13.79 v1(11.3,13.98) ; 9.45,4.69 9.45,5.82 9.54,5.92 9.54,6.43 9.1,6.88 ; v1(8.96,6.94) 9.32,6.94 10.24,7.86 10.88,7.86
  Bottom Layer w0.254: 22.78,5.67 22.78,6.15 21.3,7.63 21.3,8.87 21.38,8.95 ; 21.2,12.19 20.47,12.91 v1(13.51,12.91) ; C14.2 20.45,9.95 20.45,10.98 21.12,11.65 21.12,11.9
  Bottom Layer w0.305: 24,7.15 25.13,6.01 26.77,6.01
  Bottom Layer w0.406: 23.91,8.55 23.95,8.52 R9.2
  vias: v1(7.49,9.75) v1(22.47,5.73) v2(27.89,8.88)
+3.3VO: length 3.5
  Bottom Layer w0.406: 28.84,3.2 28.84,2.34 29.5,1.69 H1.12 ; 29.03,4.95 28.92,4.84 C12.1
GND: length 20.9
  Top Layer w0.152: 23.48,11.66 23.48,11.66 ; 23.48,11.66 23.44,11.62 ; 23.48,11.66 23.4,11.58 ; 23.44,11.58 23.44,11.62 ; 23.44,11.58 23.4,11.58 ; 23.44,11.58 23.4,11.56 23.4,11.55 23.44,11.55 23.44,11.62 ; 23.44,11.58 23.44,11.64 ; 23.44,11.62 23.4,11.58 ; U8.4 25.53,11.69 25.53,12.09 ; 23.4,11.58 23.35,11.53 22.85,11.53 22.84,11.52 ; 23.47,11.67 v1(23.47,11.67) 23.71,11.91 23.71,12.53 24.44,13.26 24.57,13.26
  Bottom Layer w0.127: U9.13 31.3,7.66
  Bottom Layer w0.152: C19.1 23.1,10.15 25.18,10.15 25.44,10.4 C15.1 26.82,10.4 27.15,10.73 28.27,10.73 28.44,10.56 ; 10.25,5.58 13.01,5.58 13.88,6.45 ; 9.61,3.41 10.24,4.05 v1(10.24,6.99) ; C3.1 13.64,11.53 12.91,12.26 12.91,12.63 12.66,12.88
  vias: v1(1.59,13.79) v1(2.05,5.16) v1(3.96,7.53) v1(5.64,9.97) v1(5.65,7.48) v1(5.76,13.01) v1(6.24,11.59) v1(9.2,8.6) v1(9.51,9.69) v1(10.15,13.81) v1(11.38,10.87) v1(12.53,12.98) v1(13.26,14.19) v1(15.16,11.57) v1(15.13,8.52) v1(15.66,15.57) v1(17.35,6.35) v1(18.99,9.48) v1(19.94,11.37) v1(20.25,2.56) v1(20.39,6.59) v1(21.04,10.46) v1(21.46,13.38) v1(23.07,13.96) v1(24.66,13.34) v1(25.49,12.12) v1(25.7,10.98) v1(27.88,6.95) v1(28.06,13.17) v1(28.09,12.18) v1(28.04,4.01) v1(30.18,3.9) v1(30.32,8.04) v1(30.42,10.55) v1(30.35,9.05) v1(30.9,12.04) v1(30.9,11.33) v1(30.86,8.54) v1(30.87,7.53) v1(31.35,10.54) v1(31.38,9.06) v1(31.41,8.03) v1(32.66,5.58) v1(33.33,10.55) v1(34.72,6.21) v1(34.74,5.53) v1(36.16,6.24) v1(36.19,5.54) v1(39.49,11.93) v1(39.52,11.06) v1(39.49,10.22) v1(39.48,9.41)
+BTO: length 33.5
  Bottom Layer w0.152: 1.85,12.63 0.75,11.54 0.75,4.18 2.26,2.68 9.67,2.68 10.17,2.18 10.7,2.18 11.25,2.74 12.96,2.74 14.18,1.51
  Bottom Layer w0.406: 15.83,3.31 15.97,3.31 Q1.3 ; 14.2,1.46 14.2,1.85 C11.2 14.89,4.16 14.89,5.59 16.3,7 16.3,7.17 R2.2
BT+: length 35.1
  Top Layer w0.152: R14.2 34.42,13.22 33.55,12.34 D2.1 33.81,12.32 34.28,11.86
  Bottom Layer w0.152: 33.41,8.11 33.36,8.16 U9.12
  Bottom Layer w0.203: C23.2 31.49,6.15 32.5,6.15 33.55,7.2 33.55,7.36
  Bottom Layer w0.254: 30.67,5.68 30.4,5.68 29.94,6.13 29.42,6.13 U9.1 ; R7.2 21.47,4.16
  Bottom Layer w0.305: 42.11,16.26 41.39,15.53 36.61,15.53 36.43,15.35 35.5,15.35 34.3,14.15 34.3,9.35 34.12,9.17 ; 21.45,4.16 21.39,4.07 21.45,4.16 22.06,4.91 24.04,4.91 24.69,5.56 25.32,5.56 25.5,5.37 27.18,5.37 27.94,6.13 29.42,6.13
  Bottom Layer w0.406: Q1.1 21.16,3.84 21.47,4.16
  vias: v1(33.52,7.71) v1(34.1,7.31) v1(34.14,8.21) v1(34.29,11.74) v1(34.72,7.7)
D+: length 17
  Top Layer w0.127: 37.93,9.29 37.97,9.29 37.98,9.3 38.18,9.49 38.18,10.05 37.92,10.3 ; 36.85,10.26 36.85,10.27 36.37,10.27 35.98,9.88 29.32,9.88 28.61,10.6 28.3,10.6 27.75,11.16 27.59,11.16 27.59,11.27 27.62,11.27 v1(27.62,11.27) ; 23.89,10.75 23.65,10.51 22.35,10.51
  Bottom Layer w0.127: v1(24.01,10.7) 24.04,10.72 24.44,10.72 25.23,11.51 26.5,11.51 26.74,11.27 27.58,11.27
D-: length 17.1
  Top Layer w0.127: 36.59,9.8 36.29,9.8 36.1,9.61 29.21,9.61 28.49,10.32 28.3,10.32 28.05,10.07 27.63,10.07 v1(27.58,10.12) ; 36.59,9.8 36.95,9.8 36.95,9.8 ; 36.59,9.8 36.59,8.94 36.74,8.8 37.21,8.8 37.21,8.8 ; 22.35,10.01 23.54,10.01 v1(24.04,9.51)
  Bottom Layer w0.127: v1(24.04,9.51) 24.04,9.55 24.21,9.73 27.33,9.73 27.63,10.02
EN-PW: length 6.5
  Top Layer w0.152: v1(12.48,11.27) 12.6,11.27 12.87,11 13.63,11
  Bottom Layer w0.152: 16.79,11.57 16.79,11.26 16.47,10.93 14.94,10.93 14.63,10.62 13.13,10.62 v1(12.48,11.27) 12.53,11.23
KEY0: length 27.8
  Top Layer w0.152: 13.63,7.5 13.03,7.5 12.5,6.97 12.5,6.35 12.21,6.06 9.73,6.06 9.6,6.19 9.6,7.1 8.96,7.74 8.88,7.74 8.58,8.04 8.58,12.01 SW3.1
  Bottom Layer w0.152: H3.8 18.61,16.73 17.55,17.79 11.01,17.79 10.35,17.13 10.35,16.22 9.62,15.49 9.32,15.49 7.29,13.46 v1(7.24,13.46)
LED0: length 13.6
  Top Layer w0.152: 13.63,10.5 12.56,10.5
  Bottom Layer w0.152: R11.2 4.21,8.61 7.38,8.61 7.93,9.15 9.74,9.15 10.58,10 11.56,10 12.07,10.51 v1(12.49,10.51)
PA1: length 39.1
  Top Layer w0.152: 13.63,7 13.05,7 12.84,6.78 12.84,6.16 12.44,5.76 9.34,5.76 8.41,6.69 8.41,7.34 8.21,7.54 7.46,7.54 v1(7.15,7.86) 6.38,8.63 6.38,10.98 6.78,11.37 6.78,11.81 6.44,12.14 6.44,13.91 6.74,14.21 9.71,14.21 10.67,15.17 14.45,15.17 16.01,16.73 H3.7
  Bottom Layer w0.152: v1(7.15,7.86) 7.35,8.06 9.42,8.06 9.74,8.38 9.74,8.72 10.7,9.68 11.68,9.68 11.94,9.95 12.69,9.95 12.85,10.11 15.26,10.11 15.27,10.1 ; 15.62,10.06 16.36,9.32 16.36,8.73 ; 7.76,5.59 8.45,5.59 v1(8.93,6.07)
PA2: length 24.1
  Top Layer w0.152: 13.85,6.51 13.85,6.35 12.94,5.43 5.61,5.43 5.08,5.97 5.08,13.09 6.87,14.89 9.47,14.89 11.09,16.51
PA3: length 27.5
  Top Layer w0.152: 1.39,16.48 0.49,15.57 0.49,5.45 1.72,4.22 15.2,4.22 15.35,4.36 15.35,5.01
PA4: length 29.4
  Top Layer w0.152: 3.7,16.24 2.66,15.21 2.07,15.21 0.79,13.94 0.79,5.58 1.85,4.52 14.5,4.52 14.9,4.92 14.9,5.88 15.05,6.02 15.72,6.02 15.83,5.91 15.83,5.41 15.83,5.41
PA5: length 30.1
  Top Layer w0.152: 6.5,16.56 6.5,15.88 5.51,14.89 3.26,14.89 2.22,13.85 2.22,5.78 3.18,4.83 14.38,4.83 14.6,5.04 14.6,6.01 14.91,6.32 15.85,6.32 16.35,5.82 16.35,5.49
PA6: length 28
  Top Layer w0.152: v1(15.27,7.32) 15.99,6.59 15.98,6.63 16.86,5.74 16.86,5.35 ; v1(14.05,5.4) 13.75,5.4 13.48,5.13 5.49,5.13 4.77,5.85 4.77,13.22 6.85,15.29 8.23,15.29 9.29,16.35
  Bottom Layer w0.152: v1(14.05,5.4) 14.78,6.14 14.78,6.37 15.27,6.86 v1(15.27,7.32)
PA7: length 17.3
  Top Layer w0.152: 17.37,4.62 17.34,4.59 17.34,4.24 17.01,3.91 3.78,3.91 1.54,1.68
PA8: length 13.4
  Top Layer w0.152: 31.89,1.84 31.89,2.02 31.39,2.51 27.24,2.51 25.91,3.84 25.91,5.59 22.99,8.51 22.35,8.51
PA9: length 16.1
  Top Layer w0.152: 22.35,9.01 23.06,9.01 23.55,8.52 23.55,8.39 26.35,5.58 26.35,3.84 27.37,2.82 33.78,2.82 34.52,2.08
PA10: length 24.7
  Top Layer w0.152: 22.35,9.51 23.15,9.51 24.38,8.28 26.9,8.28 27.1,8.48 27.1,9.12 27.57,9.59 28.23,9.59 28.57,9.25 28.57,8.33 28.41,8.16 28.13,8.16 26.92,6.95 26.92,3.99 27.79,3.12 35.42,3.12 36.78,1.77
PA15: length 16.1
  Top Layer w0.152: 20.35,13.51 20.35,14.46 20.49,14.6 27.58,14.6 27.92,14.95 30.85,14.95 31.52,15.62 33.08,15.62 34.19,16.73 H3.14
PB0: length 15.3
  Top Layer w0.152: 4.06,1.62 6.05,3.61 17.26,3.61 17.83,4.17 17.83,4.62 17.86,4.65
PB1: length 13.1
  Top Layer w0.152: 6.67,1.6 8.37,3.3 17.58,3.3 18.34,4.06 18.34,4.48 18.34,4.48
PB2: length 50.3
  Top Layer w0.152: 9.1,1.51 8.88,1.73 8.88,2.11 9.77,3 18.08,3 18.84,3.76 18.84,4.5
  Bottom Layer w0.152: R1.1 R16.2 10.96,3.23 10.5,2.77 10.45,2.77 v1(10.44,2.76) ; 36.79,11.34 37.49,10.64 37.49,8.48 38.32,7.65 38.71,7.65 39.37,6.99 39.37,6.26 40.22,5.41 40.22,3.03 39.83,2.64 31.52,2.64 31.25,2.91 31.25,4.15 30.86,4.54 30.34,4.54 29.95,4.93 29.95,5.62 29.85,5.73 28.21,5.73 27.88,5.39 27.88,4.69 27.38,4.19 27.38,3.69 26.96,3.26 18.78,3.26 v1(18.54,3.5)
PB3: length 13.5
  Top Layer w0.152: 19.85,13.51 19.85,14.39 20.37,14.91 27.35,14.91 28.03,15.58 30.9,15.58 31.66,16.35
PB4: length 20.1
  Top Layer w0.152: 36.75,16.58 35.86,15.7 33.59,15.7 33.21,15.31 31.74,15.31 31.05,14.63 28.19,14.63 27.86,14.3 24.32,14.3 22.7,12.68 21.42,12.68 21.12,12.38 19.63,12.38 19.35,12.66 19.35,13.51
PB5: length 23.4
  Top Layer w0.152: 18.85,13.51 18.85,12.69 19.55,11.99 21.17,11.99 21.55,12.38 22.9,12.38 24.52,13.99 27.98,13.99 28.24,14.25 31.37,14.25 32.13,15.01 33.33,15.01 33.72,15.39 35.99,15.39 36.1,15.5 38.43,15.5 39.31,16.39
PB6: length 13
  Top Layer w0.152: H3.12 28.61,16.73 27.09,15.21 20.24,15.21 19.81,14.78 18.67,14.78 18.35,14.46 18.35,13.51
PB7: length 10.6
  Top Layer w0.152: 25.45,15.52 26.44,16.51 ; 25.45,15.52 25.52,15.59 25.46,15.52 25.45,15.52 ; 25.45,15.52 20.11,15.52 19.68,15.09 18.49,15.09 17.87,14.47 17.87,14.16 17.85,14.13 17.85,13.51
PB8: length 10.2
  Top Layer w0.152: v1(20.66,16.15) 20.66,16.03 20.19,16.03 19.56,15.39 17.4,15.39 16.82,14.81 16.82,14.37 16.85,14.34 16.85,13.51
  Bottom Layer w0.152: v1(20.66,16.15) 20.84,15.96 20.84,15.87 21.17,15.54 23.59,15.54 24.41,16.37
PB9: length 8.7
  Top Layer w0.152: 21.66,17.19 21.09,17.75 18.91,17.75 18.12,16.96 18.12,16.26 17.56,15.7 16.8,15.7 16.35,15.25 16.35,13.51
PB10: length 9.5
  Top Layer w0.152: 19.34,4.48 19.34,3.37 18.48,2.51 12.75,2.51 H1.5
PB11: length 4.8
  Top Layer w0.152: H1.7 17.88,1.49 19.85,3.45 19.85,4.43
PB12: length 8.6
  Top Layer w0.152: 22.35,6.51 23.21,6.51 23.51,6.22 23.51,4.24 23.14,3.87 22.47,3.87 20.08,1.49 H1.8
PB13: length 7.7
  Top Layer w0.152: 22.35,7.01 23.2,7.01 24.11,6.1 24.11,3.72 H1.9
PB14: length 6.9
  Top Layer w0.152: 22.77,7.5 22.8,7.52 23.12,7.52 24.42,6.22 H1.10
PB15: length 12.5
  Top Layer w0.152: 22.67,8.01 22.71,7.97 23.1,7.97 25,6.07 v1(25,4.79) 25,3.72 26.8,1.92
  Bottom Layer w0.152: 22.85,4.15 24.37,4.15 v1(25,4.79) ; 25.03,4.72 25.91,4.72 Q2.2 26.68,4.2 26.81,4.07
PC13: length 9.3
  Top Layer w0.152: 13.63,11.5 13.13,11.5 12.5,12.13 12.34,12.13 v1(12.32,12.11)
  Bottom Layer w0.152: 14.6,16.45 15,16.06 15,13.84 14.72,13.56 12.16,13.58 11.83,13.25 11.83,12.88 12.43,12.29 12.43,12.08 12.38,12.13 12.34,12.13 v1(12.32,12.11)
SWCLK: length 7.4
  Top Layer w0.152: U8.3 25.36,10.11 24.47,11 24.47,11.36 24.61,11.5 v1(24.61,12.02) ; 20.88,13.98 21.99,13.98 v1(22.03,13.94)
  Bottom Layer w0.152: v1(24.61,12.02) 24.61,12.01 24.14,12.01 22.22,13.93 22.03,13.93 v1(22.03,13.94)
SWDIO: length 9.5
  Top Layer w0.152: 22.35,11.01 23.58,11.01 24.02,11.45 24.02,12.41 24.32,12.71 26.26,12.71 27.01,11.96 27.01,9.47 26.48,8.94
USB+: length 16.2
  Top Layer w0.355: 39.54,8.25 39.41,8.25 38.85,8.81 38.85,11.12 38.1,11.87 37.55,11.87 37.46,11.97
  Top Layer w0.406: USB2.B4A9 36.53,11.95 36.26,12.22 ; USB2.A4B9 38.04,7.15 39.1,8.21 39.54,8.25 v1(39.78,8.25)
  Bottom Layer w0.406: 40.69,6.8 40.91,6.57 C24.2 ; H1.17 42.2,2.46 40.94,3.71 ; 41.42,8.69 40.88,8.15 40.25,8.15
  vias: v1(39.78,7.46) v1(40.59,8.23) v1(40.56,7.47)
$1N3171: length 2.3
  Top Layer w0.152: 17.35,13.51 17.35,14.57 17.34,14.58
  Bottom Layer w0.152: R4.1 16.97,14.31 16.99,14.28
  vias: v1(17.35,14.59)
$1N3579: length 13.4
  Bottom Layer w0.152: v1(3.5,9.81) 6.33,12.65 7.45,12.65 10.02,15.22 13.32,15.22 14.3,14.24
$1N5109: length 7.5
  Top Layer w0.152: 13.63,9 12.69,9 12.56,8.88
  Bottom Layer w0.152: v1(7.57,6.62) 7.57,6.89 8.44,7.76 9.55,7.76 10.04,8.25 10.04,8.6 10.39,8.95 12.65,8.95
  vias: v1(12.5,8.79)
$1N7030: length 3.8
  Top Layer w0.152: 11.71,6.93 11.7,6.93 11.7,8.67 ; 11.84,8.95 12.4,9.5 13.63,9.5
$1N7055: length 5.5
  Top Layer w0.152: 10.03,11.18 10.03,12.33 10.26,12.56 ; 13.66,9.94 10.44,9.94 9.86,10.52
$1N11417: length 1.5
  Bottom Layer w0.152: 17.26,10.45 17.78,9.92 17.78,9.21
$1N11548: length 3.1
  Bottom Layer w0.152: 21.35,5.68 21.28,5.74 Q1.2 18.92,6.77 18.92,6.94
$1N22362: length 4.1
  Bottom Layer w0.152: U9.3 27.42,8.16 26.86,7.6
  Bottom Layer w0.203: R10.2 25.42,7.35 25.4,7.37
$1N29393:
  vias: v1(1.51,7.99)
$1N31043: length 13.3
  Top Layer w0.152: v1(37.14,14.89) 37.19,14.89 37.17,14.81 37.07,14.9 33.73,14.9 32.53,13.7 R12.2
  Bottom Layer w0.152: U3.2 41.22,11.28 40.61,11.89 40.61,13.9 39.7,14.8 37.32,14.8 37.19,14.93
$1N41930:
  vias: v1(1.66,10.84)
$1N62242: length 1.7
  Bottom Layer w0.152: U3.8 35.49,13.01 35.49,14.09
  vias: v1(35.46,14.11)
$1N66182: length 3.4
  Top Layer w0.152: 13.63,8 13.63,8 12.88,8
  Bottom Layer w0.152: 12.46,6.14 12.49,6.14 12.52,6.17 ; 12.46,6.14 12.46,7.49 12.49,7.53 ; 12.46,6.14 11.25,6.14
  vias: v1(12.78,7.97)

## Copper pours and planes (outline as drawn; the poured copper is in the pictures)
+3.3V on Bottom Layer: 25.1,9.64 29.76,9.64 29.76,8.53 25.1,8.53
+3.3V on Bottom Layer: 21.31,9.41 25.16,9.41 25.16,8.28 21.31,8.28
GND on Top Layer: -0.99,18.85 44.47,18.85 44.47,-0.57 -0.99,-0.57
GND on Bottom Layer: -0.89,20.74 45.68,20.74 45.68,-0.75 -0.89,-0.75
GND on Bottom Layer: 17.32,4.81 18.99,4.81 18.99,3.33 17.32,3.33
BT+ on Top Layer: 33.54,8.4 35,8.4 35,7.03 33.54,7.03
BT+ on Bottom Layer: 31.97,9.14 33.47,9.14 33.47,8.23 31.97,8.23
BT+ on Bottom Layer: 32.56,9.27 35.77,9.27 35.77,7.09 32.56,7.09
USB+ on Top Layer: 39.65,8.39 40.65,8.39 40.65,7.37 39.65,7.37
USB+ on Bottom Layer: 39.64,8.45 40.75,8.45 40.75,7.37 39.64,7.37
$1N17740 on Bottom Layer: 31.6,11.29 33.19,11.29 33.19,9.57 31.6,9.57
$1N17819 on Bottom Layer: 28.6,11.29 30.2,11.29 30.2,9.53 28.6,9.53

## Text on the board
Bottom Silkscreen Layer: 2022/9/13 | F0/F1COREv1T
Top Silkscreen Layer: --A6 | A2 | A3 | C13 | A1 | A0 | A15 | A7 | B0 | B1 | B2 | B10 | B11 | B12 | B13 | B14 | B15 | 3V | A8 | A9 | A10 | G | 5V | BO+ | B9 | B8 | B7 | --B6 | B+
